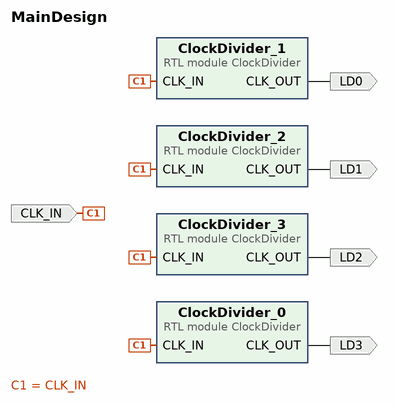
[diagram p0: block diagram of the top level]
# Vivado block design MainDesign, xc7z020clg400-1, Vivado 2022.2
create_bd_design MainDesign

create_bd_port -dir O LD0
create_bd_port -dir O LD1
create_bd_port -dir O LD2
create_bd_port -dir O LD3
create_bd_port -dir I -type clk CLK_IN
set_property -dict {CONFIG.FREQ_HZ 125000000} [get_bd_ports CLK_IN]

create_bd_cell -type module -reference ClockDivider ClockDivider_0
set_property -dict {CONFIG.DIVISOR 0x0EE6B28} [get_bd_cells ClockDivider_0]
create_bd_cell -type module -reference ClockDivider ClockDivider_1
set_property -dict {CONFIG.DIVISOR 0x7735940} [get_bd_cells ClockDivider_1]
create_bd_cell -type module -reference ClockDivider ClockDivider_2
set_property -dict {CONFIG.DIVISOR 0x3B9ACA0} [get_bd_cells ClockDivider_2]
create_bd_cell -type module -reference ClockDivider ClockDivider_3
set_property -dict {CONFIG.DIVISOR 0x1DCD650} [get_bd_cells ClockDivider_3]

# ---- connections ----

connect_bd_net [get_bd_ports CLK_IN] \
  [get_bd_pins ClockDivider_1/CLK_IN] [get_bd_pins ClockDivider_2/CLK_IN] [get_bd_pins ClockDivider_3/CLK_IN] \
  [get_bd_pins ClockDivider_0/CLK_IN]
connect_bd_net [get_bd_pins ClockDivider_0/CLK_OUT] [get_bd_ports LD3]
connect_bd_net [get_bd_pins ClockDivider_1/CLK_OUT] [get_bd_ports LD0]
connect_bd_net [get_bd_pins ClockDivider_2/CLK_OUT] [get_bd_ports LD1]
connect_bd_net [get_bd_pins ClockDivider_3/CLK_OUT] [get_bd_ports LD2]

validate_bd_design
save_bd_design
